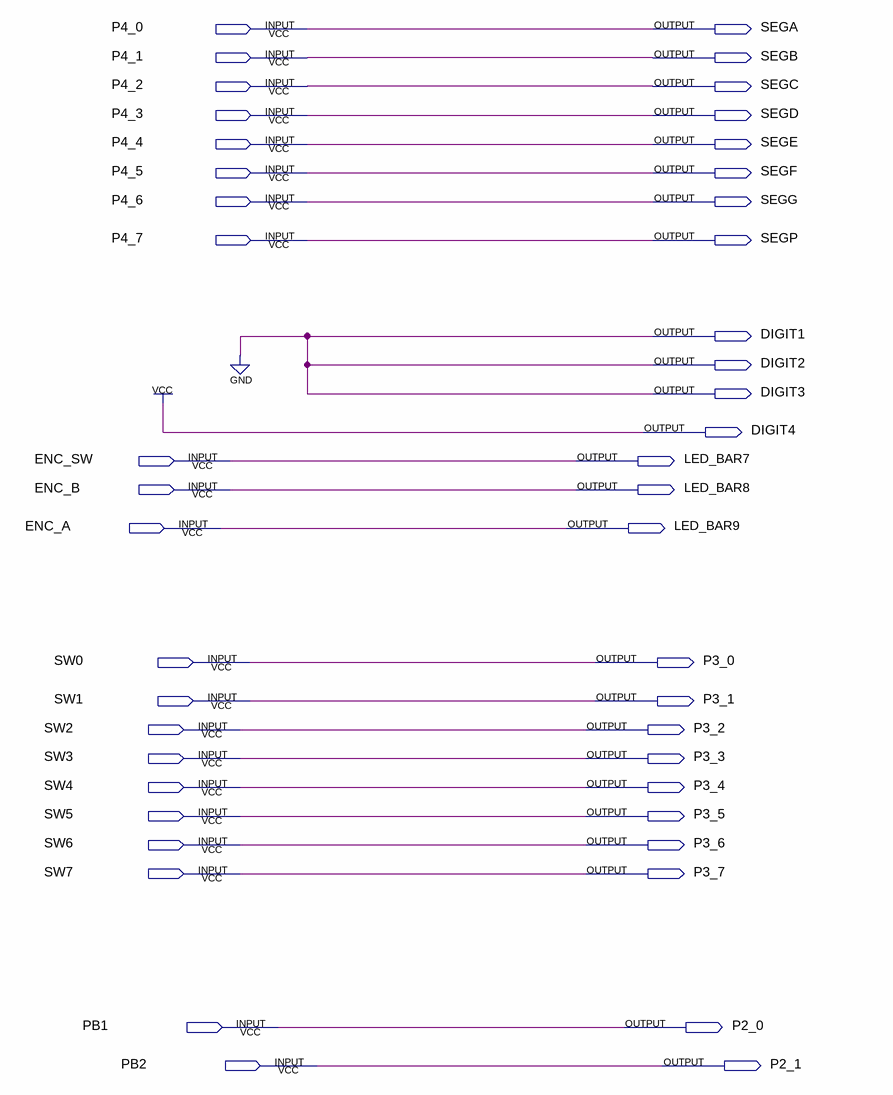
[diagram p0: schematic sheet]
// Quartus schematic ece315_top.bdf as structural Verilog: 0 symbols, 46 pins
module ece315_top (
  input  P4_0,
  input  P4_1,
  input  P4_2,
  input  P4_3,
  input  P4_4,
  input  P4_5,
  input  P4_6,
  input  P4_7,
  input  ENC_SW,
  input  ENC_B,
  input  ENC_A,
  input  SW0,
  input  SW1,
  input  SW2,
  input  SW3,
  input  SW4,
  input  SW5,
  input  SW6,
  input  SW7,
  input  PB1,
  input  PB2,
  output SEGA,
  output SEGB,
  output SEGC,
  output SEGD,
  output SEGE,
  output SEGF,
  output SEGG,
  output SEGP,
  output DIGIT1,
  output DIGIT2,
  output DIGIT3,
  output DIGIT4,
  output LED_BAR7,
  output LED_BAR8,
  output LED_BAR9,
  output P3_0,
  output P3_1,
  output P3_2,
  output P3_3,
  output P3_4,
  output P3_5,
  output P3_6,
  output P3_7,
  output P2_0,
  output P2_1
);


  assign DIGIT1 = 1'b0;
  assign DIGIT2 = 1'b0;
  assign DIGIT3 = 1'b0;
  assign DIGIT4 = 1'b1;
  assign LED_BAR7 = ENC_SW;
  assign LED_BAR8 = ENC_B;
  assign LED_BAR9 = ENC_A;
  assign P2_0 = PB1;
  assign P2_1 = PB2;
  assign P3_0 = SW0;
  assign P3_1 = SW1;
  assign P3_2 = SW2;
  assign P3_3 = SW3;
  assign P3_4 = SW4;
  assign P3_5 = SW5;
  assign P3_6 = SW6;
  assign P3_7 = SW7;
  assign SEGA = P4_0;
  assign SEGB = P4_1;
  assign SEGC = P4_2;
  assign SEGD = P4_3;
  assign SEGE = P4_4;
  assign SEGF = P4_5;
  assign SEGG = P4_6;
  assign SEGP = P4_7;
endmodule
